# EAGLE design Addon-mapleCUx_Raspi-3V3-UART-CC2530-V02-02 (EAGLE 9.1.0)
MAPLE-CUx Large Version
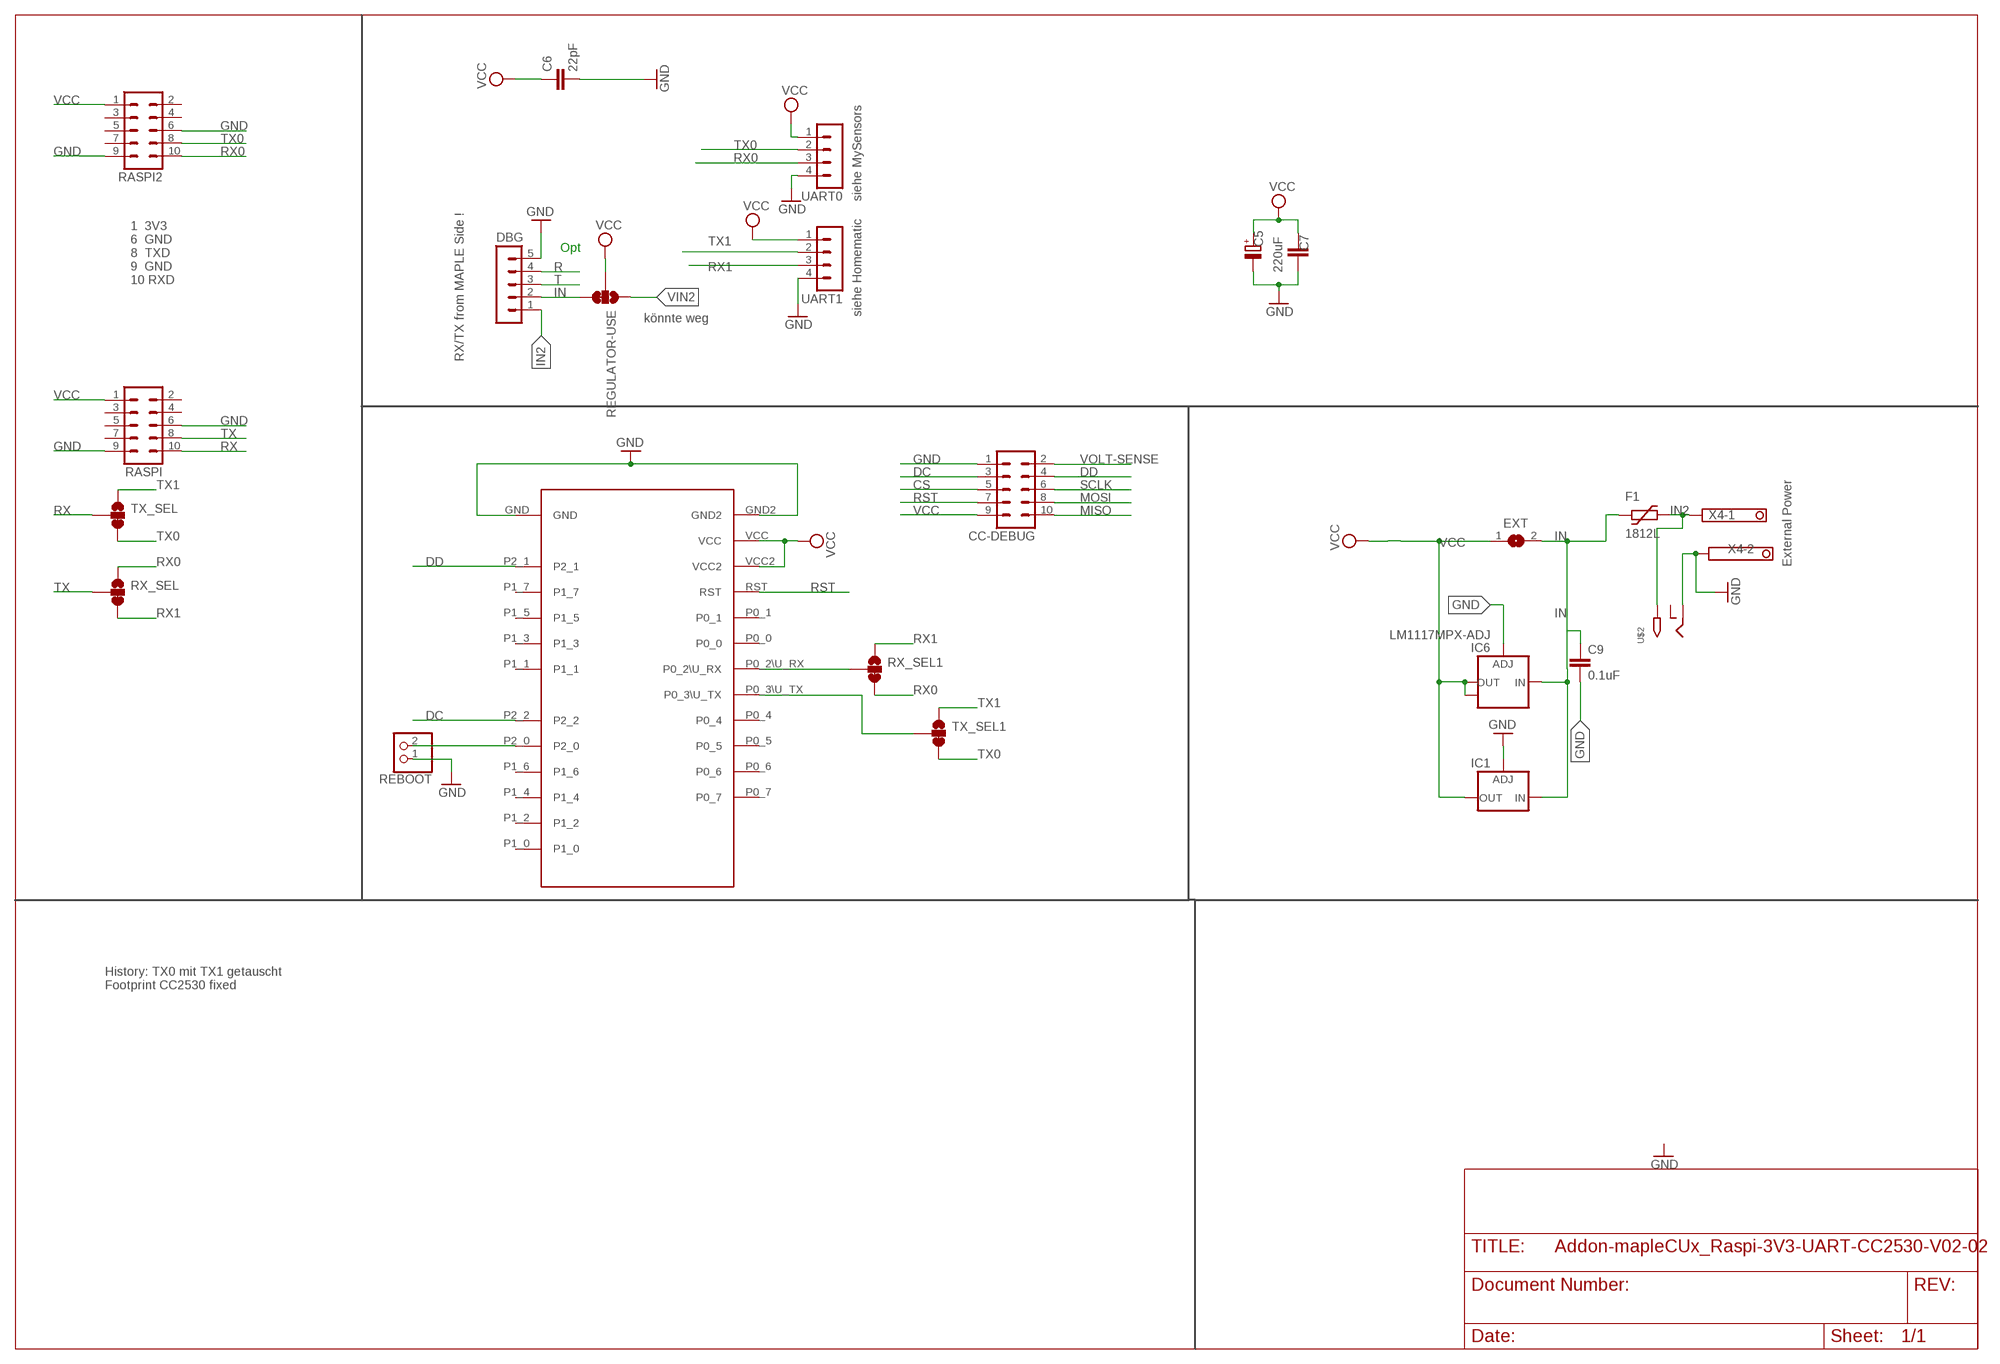
[diagram p0: schematic, sheet 1]

## Parts
C5  220uF  CPOL-EUE5-8.5  [E5-8,5]
C6  22pF  C-EUC0805  [C0805]
C7  C-EUC1812  [C1812]
C9  0.1uF  C-EUC1206  [C1206]
CC-DEBUG  MA05-2  [MA05-2]
DBG  MA05-1  [MA05-1]
EXT  SJ  [SJ]
F1  1812L  [1812L]
IC1  LD117ADT50TR  [DPACK]
IC6  LM1117MPX-ADJ  [SOT223]
RASPI  MA05-2  [MA05-2]
RASPI2  MA05-2  [MA05-2]
REBOOT  PINHD-1X2  [1X02]
REGULATOR-USE  JUMPER-SMT_3_1-NC_TRACE_SILK  [SMT-JUMPER_3_1-NC_TRACE_SILK]
RX_SEL  JUMPER-SMT_3_1-NC_TRACE_SILK  [SMT-JUMPER_3_1-NC_TRACE_SILK]
RX_SEL1  JUMPER-SMT_3_1-NC_TRACE_SILK  [SMT-JUMPER_3_1-NC_TRACE_SILK]
TX_SEL  JUMPER-SMT_3_1-NC_TRACE_SILK  [SMT-JUMPER_3_1-NC_TRACE_SILK]
TX_SEL1  JUMPER-SMT_3_1-NC_TRACE_SILK  [SMT-JUMPER_3_1-NC_TRACE_SILK]
U$2  2.1MMJACKTHM  [PJ-102A]
U$3  CC2530_MODULE  [CC2530_DIL]
UART0  MA04-1  [MA04-1]
UART1  MA04-1  [MA04-1]
X4  1751248  [1751248]

## Nets
CS: CC-DEBUG.5
DC: CC-DEBUG.3 U$3.P2_2
DD: CC-DEBUG.4 U$3.P2_1
GND [PWR]: C5.- C6.2 C7.1 C9.2 CC-DEBUG.1 DBG.5 IC1.1(ADJ) IC6.1(ADJ) RASPI2.6 RASPI2.9 RASPI.6 RASPI.9 REBOOT.1 U$2.RING U$3.GND U$3.GND2 UART0.4 UART1.4 X4.2
IN [PWR]: C9.1 DBG.2 EXT.2 F1.P$1 IC1.3(IN) IC6.3(IN) REGULATOR-USE.3
IN2 [PWR]: DBG.1 F1.P$2 U$2.TIP X4.1
MISO: CC-DEBUG.10
MOSI: CC-DEBUG.8
N$1: REBOOT.2 U$3.P2_0
N$2: RX_SEL1.2 U$3.P0_2\U_RX
N$3: TX_SEL1.2 U$3.P0_3\U_TX
R: DBG.4
RST: CC-DEBUG.7 U$3.RST
RX: RASPI.10 TX_SEL.2
RX0: RASPI2.10 RX_SEL1.3 RX_SEL.1 UART0.3
RX1: RX_SEL1.1 RX_SEL.3 UART1.3
SCLK: CC-DEBUG.6
T: DBG.3
TX: RASPI.8 RX_SEL.2
TX0: RASPI2.8 TX_SEL1.3 TX_SEL.3 UART0.2
TX1: TX_SEL1.1 TX_SEL.1 UART1.2
VCC [PWR]: C5.+ C6.1 C7.2 CC-DEBUG.9 EXT.1 IC1.4(OUT) IC6.2(OUT) IC6.TAB(OUT1) RASPI2.1 RASPI.1 REGULATOR-USE.2 U$3.VCC U$3.VCC2 UART0.1 UART1.1
VIN2 [PWR]: REGULATOR-USE.1
VOLT-SENSE: CC-DEBUG.2
Unconnected: RASPI2.2 RASPI2.3 RASPI2.4 RASPI2.5 RASPI2.7 RASPI.2 RASPI.3 RASPI.4 RASPI.5 RASPI.7 U$2.RING_SW U$3.P0_0 U$3.P0_1 U$3.P0_4 U$3.P0_5 U$3.P0_6 U$3.P0_7 U$3.P1_0 U$3.P1_1 U$3.P1_2 U$3.P1_3 U$3.P1_4 U$3.P1_5 U$3.P1_6 U$3.P1_7

## Notes on the sheet
- siehe MySensors
- Opt
- 1  3V3
  6  GND
  8  TXD
  9  GND
  10 RXD
- siehe Homematic
- könnte weg
- RX/TX from MAPLE Side !
- External Power
- History: TX0 mit TX1 getauscht
  Footprint CC2530 fixed

## Library data of the parts
C5 = rcl:CPOL-EU: POLARIZED CAPACITOR, European symbol
C6 C7 C9 = rcl:C-EU: CAPACITOR, European symbol
CC-DEBUG RASPI RASPI2 = con-lstb:MA05-2: PIN HEADER; OC_FARNELL: unknown; OC_NEWARK: unknown
DBG = con-lstb:MA05-1: PIN HEADER; OC_FARNELL: unknown; OC_NEWARK: unknown
EXT = jumper:SJ: SMD solder JUMPER
F1 = ptc-littlefuse:1812L
IC1 = v-reg:LD117A?*: Low drop fixed and adjustable positive voltage regulators 1 A Source: http://www.st.com/stonline/products/literature/ds/7194/ld1117axx.pdf
IC6 = lm1117:LM1117MPX-ADJ
REBOOT = pinhead:PINHD-1X2: PIN HEADER
REGULATOR-USE RX_SEL RX_SEL1 TX_SEL TX_SEL1 = SparkFun-Jumpers:JUMPER-SMT_3_1-NC_TRACE: Normally closed trace jumper (1 of 2 connections) This jumper has a trace between two pads so it's normally closed (NC). The other connection is normally open (NO). Use a razor knife to open the connection. For best results follow the IPC guidelines for cutting traces: Cutout at least 0.063 mm (0.005 in). Remove all loose material to clean up the cut area. Seal the cut with an approved epoxy. Reapply solder to reclose the connection, or to close the NO connection.
U$2 = adafruit:2.1MMJACK: 2.1mm x 5.5mm THM DC jack with internal switch. Digikey part #PJ-102A, 4UCON part #05537 2.1mm x 5.5mm SMT DC jack with internal switch. Digikey part #PJ-002A-SMT, 4UCON part #03267 By microbuilder.eu & adafruit.com
U$3 = Martin-Communication-V4:CC2530_MODULE
UART0 UART1 = con-lstb:MA04-1: PIN HEADER; OC_FARNELL: unknown; OC_NEWARK: unknown
X4 = con-phoenix-350:1751248: MKDS 1/ 2-3,5 Printklemme Nennstrom: 10 A Bemessungsspannung: 160 V Raster: 3,5 mm Polzahl: 2 Montageart: Löten Anschlussart: Schraubanschluss Anschlussrichtung vom Leiter zur Platine: 0° Source: http://eshop.phoenixcontact.com .. 1751248.pdf; OC_FARNELL: unknown; OC_NEWARK: unknown

## Net classes
0 default: width 0.305 mm
1 PWR: width 0.914 mm

## Board
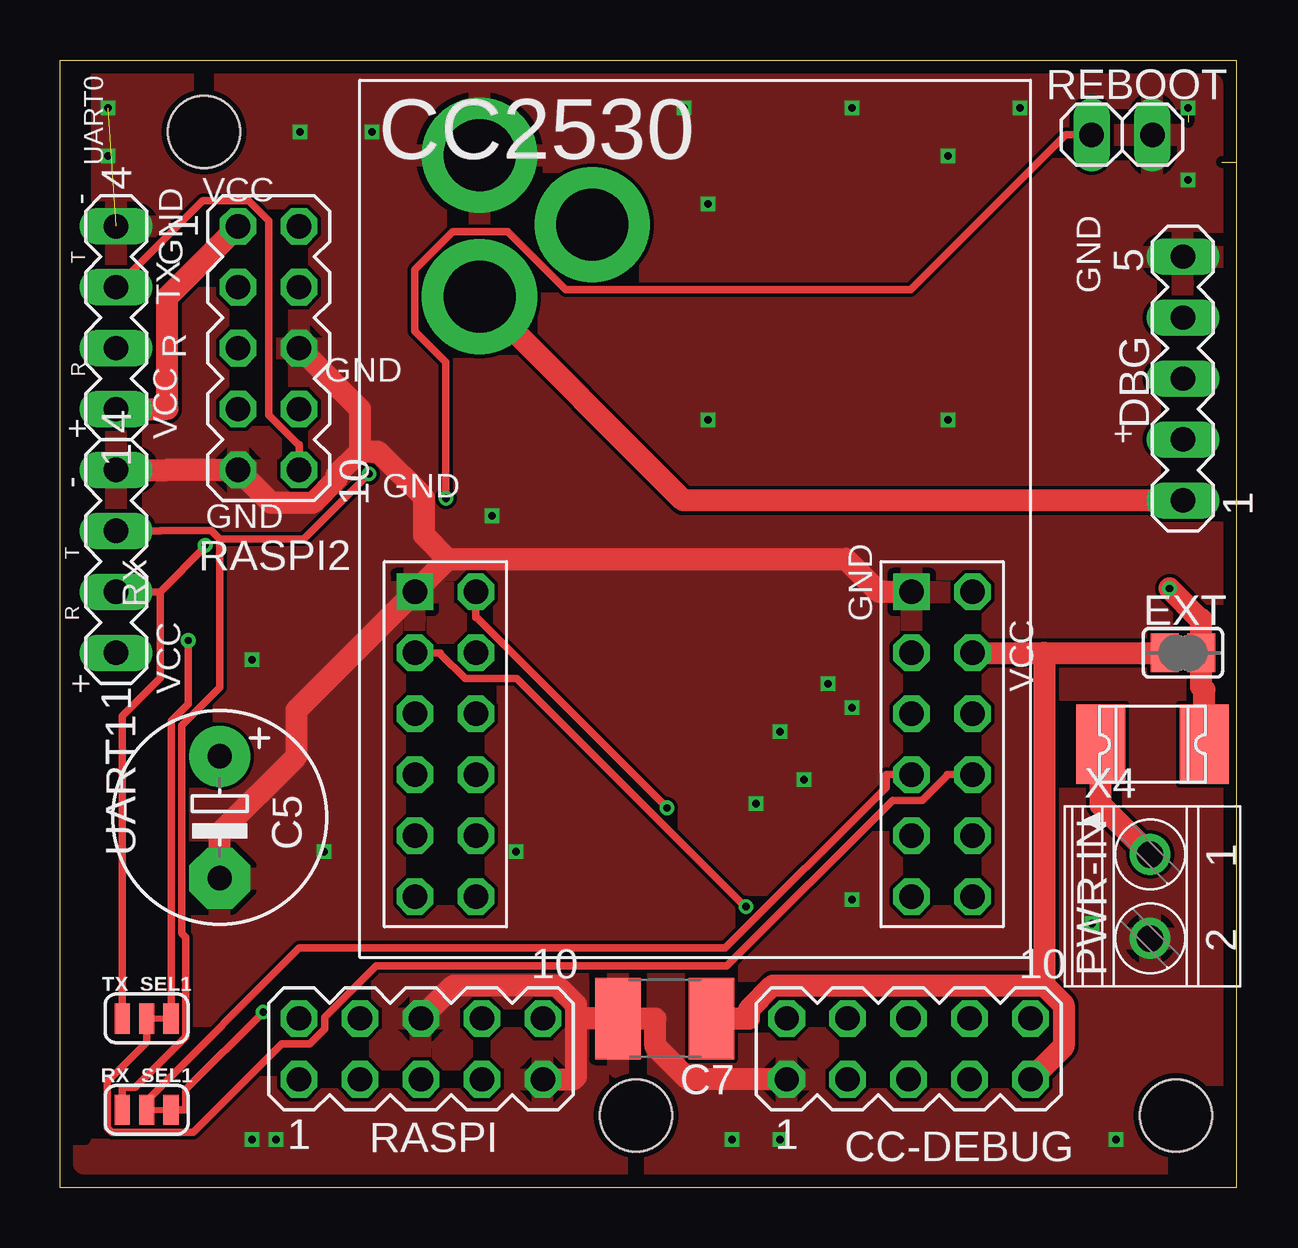
[diagram p1: board, top side]
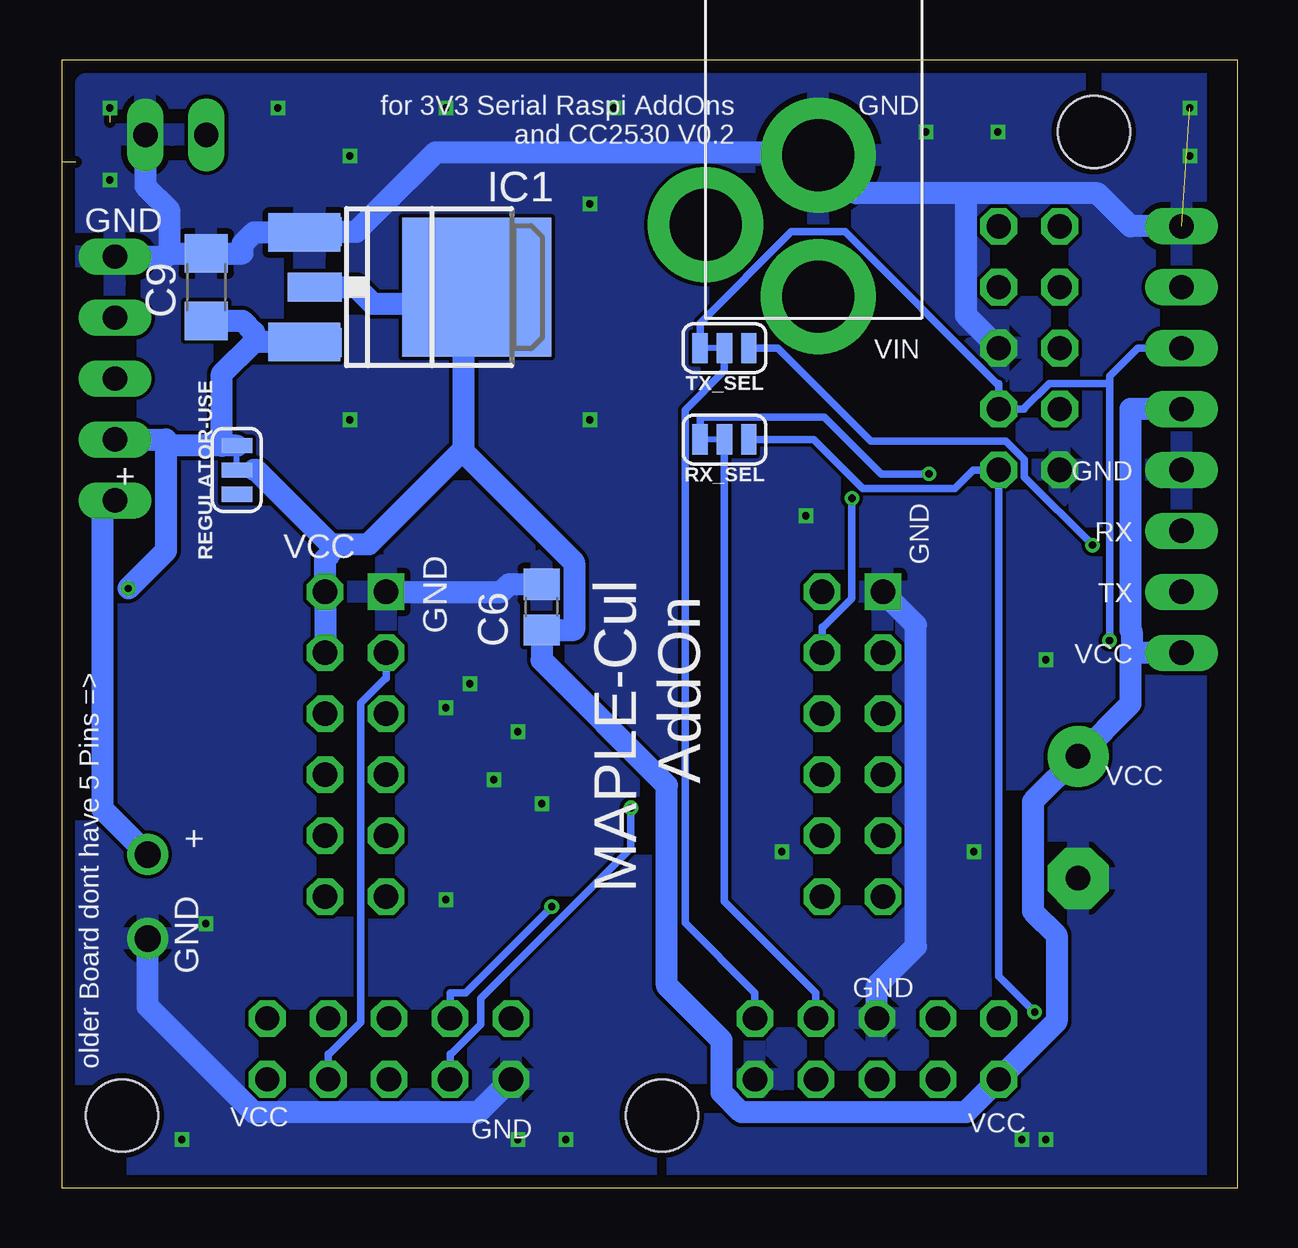
[diagram p2: board, bottom side, seen from below]

Size 49 x 47 mm. Coordinates in mm from the lower left corner, seen from the top.
Outline: 49,47 49,46.24
Outline: 47,44.7 47,44.41
Outline: 48.41,42.75 49,42.75
Outline: 49,47 0,47 0,0 49,0 49,42.75
Outline: 49,47 49,42.75
Copper layers (1*16): Top 0.035mm / dielectric 1.5mm / Bottom 0.035mm
Design rules "SeeedStudio_2layer_DRU_no_angle_20140221": minimum track width 6mil, minimum drill 12mil, track to track 6mil, track to pad 6mil, pad to pad 6mil, via to via 6mil, smd to smd 0mil, copper to edge 10mil, drill to drill 10mil, minimum pad ring 10mil, minimum via ring 6mil, stop-mask expansion 2mil, vias tented up to drill 100mil, thermal gap 10mil
Holes 3 mm at 6,44 24,3 46.5,3
tRestrict: area 0.4,2 to 1.1,47.1
bRestrict: area 0.4,0.7 to 1.1,46.4

### Footprints (pad centres in the part's own frame; a part is rotated, then mirrored left to right if it is on the bottom)
E5-8,5 = drill 1.016 pad 2.54: + -2.54,0 | drill 1.016 pad 2.54 octagon: - 2.54,0
C0805 = smd 1.3 x 1.5: 1 -0.95,0; 2 0.95,0
C1812 = smd 1.9 x 3.4: 1 -1.95,0; 2 1.95,0
C1206 = smd 1.6 x 1.8: 1 -1.4,0; 2 1.4,0
MA05-2 = drill 1.016 octagon: 1 -5.08,-1.27; 2 -5.08,1.27; 3 -2.54,-1.27; 4 -2.54,1.27; 5 0,-1.27; 6 0,1.27; 7 2.54,-1.27; 8 2.54,1.27; 9 5.08,-1.27; 10 5.08,1.27
MA05-1 = drill 1.016 long: 1 -5.08,0; 2 -2.54,0; 3 0,0; 4 2.54,0; 5 5.08,0
SJ = smd 1.168 x 1.6: 1 -0.762,0; 2 0.762,0
1812L = smd 2.03 x 3.3: P$1 -2.16,0; P$2 2.16,0
DPACK = smd 1.6 x 3: 1 -2.28,-4.8; 3 2.28,-4.8 | smd 5.8 x 6.2: 4 0,2.38
SOT223 = smd 1.219 x 2.235: 1 -2.311,-3.099; 2 0,-3.099; 3 2.311,-3.099 | smd 3.6 x 2.2: TAB 0,3.099
1X02 = drill 1.016 long: 1 -1.27,0; 2 1.27,0
SMT-JUMPER_3_1-NC_TRACE_SILK = smd 0.635 x 1.27: 1 -1.016,0; 2 0,0; 3 1.016,0
PJ-102A = drill 3 pad 4.8: RING 0.1,-3.39; RING_SW -4.6,-6.29; TIP 0.1,-9.29
CC2530_DIL = drill 1.016 square: GND -11.684,-3.81; GND2 9.017,-3.81 | drill 1.016 octagon: P0_0 9.017,-8.89; P0_1 11.557,-8.89; P0_2\U_RX 9.017,-11.43; P0_3\U_TX 11.557,-11.43; P0_4 9.017,-13.97; P0_5 11.557,-13.97; P0_6 9.017,-16.51; P0_7 11.557,-16.51; P1_0 -9.144,-16.51; P1_1 -11.684,-16.51; P1_2 -9.144,-13.97; P1_3 -11.684,-13.97; P1_4 -9.144,-11.43; P1_5 -11.684,-11.43; P1_6 -9.144,-8.89; P1_7 -11.684,-8.89; P2_0 -9.144,-6.35; P2_1 -11.684,-6.35; P2_2 -9.144,-3.81; RST 9.017,-6.35; VCC 11.557,-3.81; VCC2 11.557,-6.35
MA04-1 = drill 1.016 long: 1 -3.81,0; 2 -1.27,0; 3 1.27,0; 4 3.81,0
1751248 = drill 1.1 pad 1.7: 1 -1.75,-0.1; 2 1.75,-0.1

### Placement (x,y rotation side)
C5  6.66,15.43 270 top
C6  29.01,24.2 90 bottom
C7  25.2,7.05 0 top
C9  42.98,37.53 90 bottom
CC-DEBUG  35.36,5.78 0 top
DBG  46.79,33.72 90 top
EXT  46.79,22.29 0 top
F1  45.52,18.48 180 top
IC1  34.09,37.53 270 bottom
IC6  35.36,37.53 270 bottom
RASPI  15.04,5.78 0 top
RASPI2  8.69,34.99 270 top
REBOOT  44.25,43.88 180 top
REGULATOR-USE  41.71,29.91 90 bottom
RX_SEL  21.39,31.18 180 bottom
RX_SEL1  3.61,3.24 0 top
TX_SEL  21.39,34.99 180 bottom
TX_SEL1  3.61,7.05 0 top
U$2  17.58,46.42 0 bottom
U$3  26.47,28.64 0 top
UART0  2.34,36.26 90 top
UART1  2.34,26.1 90 top
X4  45.52,12.13 270 top

### Tracks (layer width: path | path; a pad name or v marks a point on that pad's centre or on a via)
DC  (via drill 0.3 pad 0.61)
  Top 0.305: U$3.P2_2 17.33,23.76 17.36,23.76 25.29,15.84 v25.29,15.82
  Bottom 0.305: CC-DEBUG.3 32.82,5.58 32.78,5.58 31.55,6.8 31.55,7.88 25.29,14.14 v25.29,15.82
DD  (via drill 0.3 pad 0.61)
  Top 0.305: v28.59,11.71 28.54,11.71 19.03,21.22 16.88,21.22 15.85,22.25 15.85,22.29 U$3.P2_1
  Bottom 0.305: CC-DEBUG.4 32.82,8.12 32.18,8.12 v28.59,11.71
GND  (via drill 0.3 pad 0.61)  (1 unrouted)
  Top 0.914: 12.49,30.66 11.52,29.69 11.52,29.53 10.53,28.54 8.79,28.54 RASPI2.9 4.47,29.91 UART1.4 | 16.16,26.2 15.17,27.19 15.17,28.75 13.26,30.66 12.49,30.66 | RASPI2.6 12.49,32.46 12.49,30.66 | 16.16,26.2 32.74,26.2 34.12,24.83 U$3.GND2 | 16.16,26.2 U$3.GND 9.86,19.9 9.86,17.97 6.66,14.77 C5.- | CC-DEBUG.1 26.18,4.51 24.81,5.88 24.81,7.05 C7.1 21.69,7.05 21.49,7.05 | 21.49,7.05 21.49,4.62 21.38,4.51 RASPI.9 | RASPI.6 16.41,8.42 20.69,8.42 21.49,7.62 21.49,7.05
  Bottom 0.914: RASPI.6 15.04,8.42 13.41,10.05 13.41,23.46 U$3.GND | 11.33,41.44 15.89,41.44 U$2.RING 17.59,43.14 33.43,43.14 36.73,39.84 IC6.1 38.49,39.81 IC1.1 41,39.81 41.47,39.34 41.47,38.93 C9.2 44.53,38.93 | C6.2 30.37,25.14 30.68,24.83 U$3.GND2 | CC-DEBUG.1 31.66,3.13 41.01,3.13 45.42,7.55 X4.2 | REBOOT.1 45.52,41.75 44.53,40.75 44.53,38.93 | DBG.5 44.66,38.8 44.53,38.93 | 11.33,41.44 5.85,41.44 4.47,40.07 UART0.4 | 11.33,41.44 11.33,36.36 RASPI2.6
  other vias: 2,45 2,43 10,44 13,44 27,41 37,43 40,45 26,45 33,45 37,32 27,32 18,28 8,22 11,14 19,14 29,16 33,20 32,21 30,19 31,17 33,12 43,11 44,2 28,2 30,2 8,2 9,2 47,42 47,45
  pour Top: 1,46 48,46 48,1 1,1
  pour Bottom: 1,46 48,46 48,1 1,1
IN  (via drill 0.3 pad 0.61)
  Top 0.914: v46.23,24.97 47.5,23.7 47.55,23.7 EXT.2 47.55,20.87 47.68,20.74 F1.P$1
  Bottom 0.914: 42.33,30.93 42.33,33.92 41,35.25 | 42.33,30.93 42.95,30.93 44.66,30.93 | REGULATOR-USE.3 42.33,30.93 | 41,35.25 IC1.3 38.49,35.25 IC6.3 | C9.1 41.47,36.13 41,35.66 41,35.25 | 44.66,30.93 44.66,31.18 DBG.2 | v46.23,24.97 44.66,26.54 44.66,30.93
IN2
  Top 0.914: DBG.1 25.97,28.64 U$2.TIP | X4.1 43.36,15.94 F1.P$2
  Bottom 0.914: X4.1 47.3,15.76 47.3,28.13 DBG.1
N$1  (via drill 0.3 pad 0.61)
  Top 0.305: REBOOT.2 41.91,43.88 35.45,37.42 21.07,37.42 18.65,39.84 16.36,39.84 14.78,38.25 14.78,35.71 16.08,34.4 v16.08,28.73
  Bottom 0.305: U$3.P2_0 17.33,23.36 17.28,23.36 16.08,24.56 v16.08,28.73
N$2
  Top 0.305: U$3.P0_2\U_RX 34.42,17.21 34.42,16.67 27.73,9.98 9.98,9.98 3.61,3.61 RX_SEL1.2
N$3
  Top 0.305: TX_SEL1.2 3.61,6.04 1.97,4.4 1.97,2.48 2.15,2.3 5.55,2.3 9.24,5.98 10.4,5.98 11.03,6.61 11.03,7.09 13.17,9.23 27.79,9.23 34.7,16.14 35.94,16.14 36.96,17.17 36.96,17.21 U$3.P0_3\U_TX
RST
  Bottom 0.305: CC-DEBUG.7 37.9,5.58 37.86,5.58 36.55,6.88 36.55,20.2 35.53,21.22 35.49,21.22 U$3.RST
RX
  Bottom 0.305: RASPI.10 20.12,8.12 23.03,11.03 23.03,32.41 21.39,34.05 TX_SEL.2
RX0  (via drill 0.3 pad 0.61)
  Top 0.305: RASPI2.10 9.96,30.98 9.92,30.98 8.69,32.2 8.69,40.31 7.86,41.14 5.95,41.14 UART0.3 | RX_SEL1.3 5.25,3.24 5.25,4.09 v8.46,7.31
  Bottom 0.305: v8.46,7.31 9.96,8.8 RASPI2.10 11.03,29.91 11.8,29.13 15.62,29.13 17.67,31.18 19.75,31.18 RX_SEL.1
RX1  (via drill 0.3 pad 0.61)
  Top 0.305: 6.66,27.03 6.66,20.84 5.08,19.26 5.08,10.6 5.25,10.44 5.25,6.29 3.14,4.18 2.59,4.18 RX_SEL1.1 | 6.66,27.03 6.3,27.39 4.19,27.39 4.17,27.37 UART1.3 | 6.66,27.03 10.15,27.03 v12.87,29.75
  Bottom 0.305: RX_SEL.3 22.41,32.12 17.22,32.12 14.85,29.75 v12.87,29.75
TX
  Bottom 0.305: RASPI.8 17.58,8.12 21.39,11.93 RX_SEL.2
TX0  (via drill 0.3 pad 0.61)
  Top 0.305: TX_SEL1.3 4.63,7.99 | 4.63,7.99 | 4.63,7.99 4.63,19.45 5.34,20.16 v5.34,22.8
  Bottom 0.305: TX_SEL.3 22.41,36.03 18.6,39.84 16.36,39.84 10.04,33.52 9.96,33.52 RASPI2.8 8.89,32.45 8.89,32.49 7.86,33.52 5.34,33.52 | 5.34,33.52 5.34,33.81 4.17,34.99 UART0.2 | v5.34,22.8 5.34,33.52
TX1  (via drill 0.3 pad 0.61)
  Top 0.305: 4.17,24.83 6.05,26.71 v6.05,26.78 | 4.17,24.83 4.05,24.83 UART1.2 | 4.17,24.83 4.17,21.23 2.59,19.66 TX_SEL1.1
  Bottom 0.305: v6.05,26.78 8.89,29.62 8.89,30.35 9.66,31.12 15.3,31.12 19.16,34.99 TX_SEL.1
VCC
  Top 0.914: UART0.1 4.47,32.45 4.47,37.12 RASPI2.1 | 41.01,22.29 EXT.1 | C7.2 28.71,7.05 28.71,7.43 29.71,8.42 41.01,8.42 | 41.01,8.42 41.81,7.62 41.81,5.88 CC-DEBUG.9 | 41.01,22.29 41.01,8.42 | U$3.VCC2 41.01,22.29
  Bottom 0.635: 41,29.91 REGULATOR-USE.2
  Bottom 0.914: 4.47,22.29 4.47,22.38 4.43,22.42 4.43,23.18 4.47,23.22 4.47,32.45 UART0.1 | 37.82,26.82 37.82,26.41 38.03,26.2 U$3.VCC U$3.VCC2 | 41,29.91 40.91,29.91 37.82,26.82 | 37.82,26.82 36.2,26.82 32.31,30.71 | 32.31,30.71 32.26,30.77 32.26,35.12 32.26,36.83 | 32.31,30.71 27.65,26.05 27.65,23.25 C6.1 29.01,21.98 23.79,16.77 23.79,8.42 21.51,6.14 21.51,3.96 20.69,3.14 11.33,3.14 RASPI.1 7.55,6.92 7.55,10.53 8.54,11.52 8.54,16.09 C5.+ 4.47,20.16 4.47,22.29 | UART1.1 4.47,22.29 | IC6.2 36.73,37.53 36.03,36.83 32.26,36.83 | 32.26,36.83 IC6.TAB IC1.4

### Text on the board
tNames: GND | VCC | - | T | TX | GND | R | R | GND | + | VCC | + | - | GND | GND | T | R | RX | VCC | GND | VCC | + | PWR-IN
bNames: GND | for 3V3 Serial Raspi AddOns / and CC2530 V0.2 | GND | VIN | GND | + | RX | VCC | GND | GND | TX | MAPLE-Cul / AddOn | VCC | VCC | + | GND | GND | older Board dont have 5 Pins => | VCC | GND | VCC